# Altium schematic sheet LiPoBattery.SchDoc
size A4; SheetNumber: 1; SheetTotal: 1
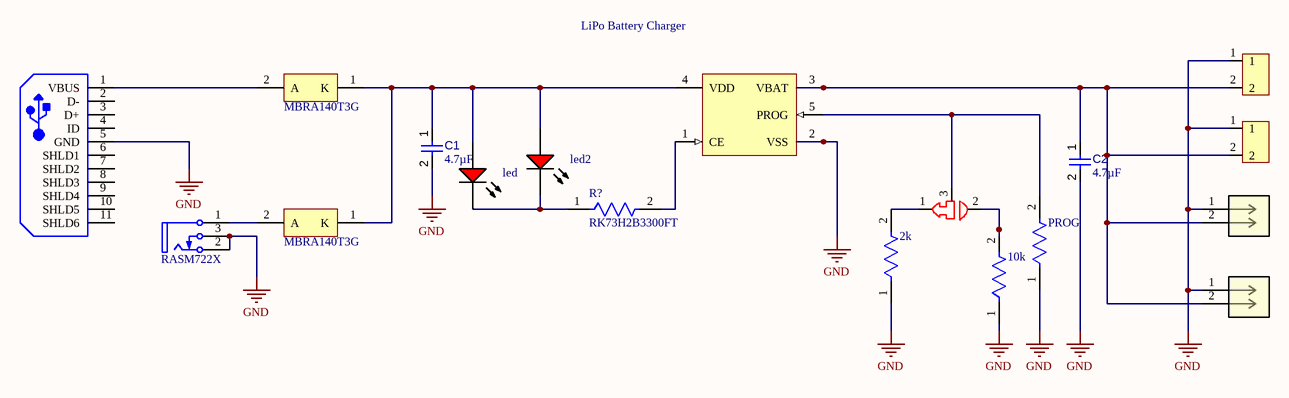
[diagram p0: LiPoBattery.SchDoc]

## Parts
(Parts that share a designator on the sheet are numbered #1, #2 ... from top to bottom, then left to right.)
2k  CR0603-JW-202GLF  [FP-CR0603-IPC_B]  (value not drawn)
10k  CRGP0603F10K  [FP-CRGP0603-IPC_C]  (value not drawn)
*#1  2 PIN HEADER  [PCBComponent_1 - duplicate]  (value not drawn)
*#2  2 PIN HEADER  [PCBComponent_1 - duplicate]  (value not drawn)
?  MCP73811T-420I/OT  [SOT-23-OT5_M]  (value not drawn)
C1  value 4.7µF  [CAPC0603(1608)100_L]  (hidden comment: Capacitor 4.7µF +/-20% 10V 0603)
C2  value 4.7µF  [CAPC0603(1608)100_L]  (hidden comment: Capacitor 4.7µF +/-20% 10V 0603)
D?#1  MBRA140T3G  [ONSC-SMA-2-403D-02_V]
D?#2  MBRA140T3G  [ONSC-SMA-2-403D-02_V]
J#1  1-179276-2  [PCBComponent_1]  (value not drawn)
J#2  1-179276-2  [PCBComponent_1]  (value not drawn)
J?#1  10103594-0001LF  [FCI-10103594-0001LF_V]  (value not drawn)
J?#2  RASM722X  [SWIT-RASM722X_V]
led  red  [VISH-TLMX1100_V]  (value not drawn)
led2  red  [VISH-TLMX1100_V]  (value not drawn)
PROG  CW02B8K200JE12  [FP-CW02B-MFG]  (value not drawn)
R?  RK73H2B3300FT  [FP-RK73H2B-IPC_C]
sjumper3pos  sjumper3pos-Symbol-1  [PCBComponent_1 - duplicate2]  (value not drawn)

## Nets
GND: 2k.1 10k.1 *#1.1 *#2.1 ?.2(VSS) C1.2 C2.2 J#1.1 J#2.1 J?#1.5(GND) J?#2.2(TIP) J?#2.3(SHUNT) PROG.1
Net2k_2: 2k.2 sjumper3pos.1
Net10k_2: 10k.2 sjumper3pos.2
Net*#1_2: *#1.2 *#2.2 ?.3(VBAT) C2.1 J#1.2 J#2.2
Net?_1: ?.1(CE) R?.2
Net?_4: ?.4(VDD) C1.1 D?#1.1(K) D?#2.1(K) led.1(A) led2.1(A)
Net?_5: ?.5(PROG) PROG.2 sjumper3pos.3
NetD?#1_2: D?#1.2(A) J?#1.1(VBUS)
NetD?#2_2: D?#2.2(A) J?#2.1(SLEEVE)
Netled_2: led.2(K) led2.2(K) R?.1

Not connected (* = marked no-connect by the designer): J?#1 2(D-) 3(D+) 4(ID) 6(SHLD1) 7(SHLD2) 8(SHLD3) 9(SHLD4) 10(SHLD5) 11(SHLD6)

## Notes on the sheet
- LiPo Battery Charger

## Library data of the parts
2k = CMP-07231-005094-1: Thick Film Chip Resistors 0603 2kΩ 0.1W 5% 200ppm/°C; Resistance: 2kR; Power Rating: 100mW; Voltage Rating: 50V; Mount: Surface Mount; Termination: SMD/SMT; Max Operating Temperature: 155°C; Depth: 0.8mm; Case Code (Imperial): 0603; Thickness: 457um; Military Standard: Not; Features: Moisture Resistant; Temperature Coefficient: 200ppm/°C; Length: 0.063inch; Case Code (Metric): 1608; Number of Terminations: 2; Packaging: Tape and Reel; Width: 0.031inch; Composition: Thick Film; Min Operating Temperature: -55°C; Height: 0.022inch; Package Quantity: 10000; Tolerance: 5%; Case/Package: 0603; Max Power Dissipation: 100mW
10k = CMP-03211-004414-1: CRGP 0603 10K 1%; Manufacturer: TE; Voltage Rating: 50V; Power Rating: 0.25W; Value: 10KΩ; Tolerance: 0.01; Temperature Coefficient: ±100ppm/°C; Octopart: https://octopart.com/crgp0603f10k-te+connectivity-91018721; Temperature Range Low: -55°C; Temperature Range High: +155°C; Device Class L3: Chip SMD Resistors; Package: CRGP0603; Height: 0.55mm; Series: CRGP; RoHS: TRUE; Composition: Thick Film; Digikey Description: CRGP 0603 10K 1%; Ipc Land Pattern Name: RESC16080X45; Mouser Description: Res, 10K, 1%, 0.25W, 0603, Thick Film; ComponentLink2Description: Datasheet; ComponentLink2URL: https://www.te.com/commerce/DocumentDelivery/DDEController?Action=srchrtrv&DocNm=9-1773463-9&DocType=DS&DocLang=English; Manufacturer Part Number: CRGP0603F10K; Temperature: -55°C to +155°C; Device Class L1: Passive Components; Lead Free: Yes; Ambient Temperature Range High: +70°C; Device Class L2: Resistors; Automotive: No; Category: Res; Resistance: 10KΩ
? = CMP-0133-00139-1: Simple, Miniature Single-Cell, Fully Integrated Li-Ion/Li-Polymer Charge Management Controller, 4.2V, 5-Pin SOT-23, Industrial Temperature, Tape and Reel; Code_IPC: SOT23-5; PackageDescription: 5-Lead Plastic Small Outline Transistor (OT) [SOT-23]; PackageVersion: revBB, Aug-2009; DatasheetVersion: revB, Sep-2007; PackageReference: SOT-23-OT5
C1 C2 = CMP-001-00076-4: Chip Capacitor, 4.7µF +/-20%, 10V, 0603, Thickness 1 mm; Tolerance: 10%; Mounting Technology: SMT; Case/Package: 0603; Pins: 2; Min Operating Temperature: -55°C; Max Operating Temperature: 85°C; Voltage Rating: 10V
D?#1 D?#2 = CMP-1055-00320-1: Schottky Power Rectifier, 2-Pin SMA, Pb-Free, Tape and Reel; Manufacturer: On Semiconductor; Configuration: Single; IFSM Max (A): 30; PackageReference: SMA-2-403D-02; PackageDescription: 2-Pin Small Molded Package, J-Bend Lead, Body 2.605 x 4.315 mm; RoHS: TRUE; ComponentLink1Description: Manufacturer URL; Packing: Tape and Reel; ComponentLink3URL: http://www.onsemi.com/pub_link/Collateral/403D-02.PDF; ComponentLink2Description: Datasheet; ComponentLink2URL: http://www.onsemi.cn/pub_link/Collateral/MBRA140T3-D.PDF; DatasheetVersion: Rev. 10; ComponentLink1URL: http://www.onsemi.com/; PartNumber: MBRA140T3G; ComponentLink3Description: Package Specification; Mounting Technology: Surface Mount; PackageVersion: Rev. G, 07/2012
J#1 J#2 = 1-179276-2: Dynamic 3000, 5.08MM Pitch 2 -way, 1 Row Right Angle Pcb Header, Solder Term; Manufacturer: TE Connectivity; Manufacturer Lifecycle Status: ACTIVE; Approvals: UL; Connector System: Wire-to-Board; Connector Type: Header, Plug, Tab; Contact Current Rating: 15A; Contact Retention: Without; Gender: Male; Insulation Resistance: 100MΩ; Mating Alignment: With; Max Voltage Rating (AC): 600V; Number of Contacts: 2; Number of Ports: 1; Operating Force: 4.8928N; PCB Thickness: 1.6002mm; Plating Thickness: 381nm; Preloaded: Yes; Sealable: No; Shielding: Unshielded; Tail Length: 3.8mm; Supplier: Arrow Electronics; Supplier Part Number: 1-179276-2; Manufacturer Part Number: 1-179276-2; RoHS: Compliant; Category: Headers and Wire Housings; Stock: 4048; Pricing: 1=2.1052, 26=1.6722, 104=1.5164, 520=1.3535, 1014=1.2943 (USD); China RoHS: Compliant; Color: Black; Contact Gender: Male; Contact Material: Gold, Nickel; Contact Plating: Gold, Tin; Current Rating: 15A; Depth: 22.1mm; Export Control Classification Number (ECCN) Code: EAR99; ELV: Compliant; Flammability Rating: UL94 V-0; Halogen Free: Halogen Free; Height: 11.25mm; Housing Color: Black; Housing Material: Nylon; Harmonized Tariff Schedule (HTS) Code: 8536.69.40.30; Introduction Date: 1997-09-06; Lead Free: Lead Free; Length: 19.0754mm; Lifecycle Status: Production; Mating Retention: With; Max Operating Temperature: 105°C; Min Operating Temperature: -55°C; Mounting Technology: Through Hole; Pins: 2; Number of Positions: 2; Number of Rows: 1; Number of Terminals: 2; Operating Supply Voltage: 600V; Orientation: Right Angle; Packaging: Bulk; PCB Mounting Orientation: Right Angle; PCB Mount Retention: With; Pitch: 5.08mm; Radiation Hardening: No; REACH SVHC: Yes; Terminal Pitch: 5.08mm; Termination: Solder; VDE Tested: No; Voltage Rating: 600V; Width: 22.098mm; ComponentLink1URL: https://datasheet.octopart.com:443/1-179276-2-TE-Connectivity-datasheet-179899453.pdf?src-supplier=IHS; ComponentLink1Description: https://datasheet.octopart.com:443/1-179276-2-TE-Connectivity-datasheet-179899453.pdf?src-supplier=IHS; ComponentLink2URL: https://sigma.octopart.com:443/15059836/technical_drawing/TE-Connectivity-1-179276-2.pdf?src-supplier=Farnell; ComponentLink2Description: https://sigma.octopart.com:443/15059836/technical_drawing/TE-Connectivity-1-179276-2.pdf?src-supplier=Farnell; ComponentLink3URL: https://datasheet.octopart.com:443/1-179276-2-TE-Connectivity-datasheet-42633666.pdf?src-supplier=Master+Electronics; ComponentLink3Description: https://datasheet.octopart.com:443/1-179276-2-TE-Connectivity-datasheet-42633666.pdf?src-supplier=Master+Electronics; ComponentLink4URL: https://datasheet.octopart.com:443/1-179276-2-TE-Connectivity---AMP-datasheet-181563238.pdf?src-supplier=Master+Electronics; ComponentLink4Description: https://datasheet.octopart.com:443/1-179276-2-TE-Connectivity---AMP-datasheet-181563238.pdf?src-supplier=Master+Electronics; ComponentLink5URL: https://datasheet.octopart.com:443/1-179276-2-TE-Connectivity-datasheet-11077907.pdf?src-supplier=Electro+Sonic; ComponentLink5Description: https://datasheet.octopart.com:443/1-179276-2-TE-Connectivity-datasheet-11077907.pdf?src-supplier=Electro+Sonic; ComponentLink6URL: https://datasheet.octopart.com:443/1-179276-2-TE-Connectivity-datasheet-155826164.pdf?src-supplier=TE+Connectivity; ComponentLink6Description: https://datasheet.octopart.com:443/1-179276-2-TE-Connectivity-datasheet-155826164.pdf?src-supplier=TE+Connectivity; ComponentLink7URL: https://datasheet.octopart.com:443/1-179276-2-Agastat-datasheet-15059020.pdf?src-supplier=TE+Connectivity; ComponentLink7Description: https://datasheet.octopart.com:443/1-179276-2-Agastat-datasheet-15059020.pdf?src-supplier=TE+Connectivity; ComponentLink8URL: https://datasheet.octopart.com:443/1-179276-2-Agastat-datasheet-15028295.pdf?src-supplier=TE+Connectivity; ComponentLink8Description: https://datasheet.octopart.com:443/1-179276-2-Agastat-datasheet-15028295.pdf?src-supplier=TE+Connectivity; ComponentLink9URL: https://datasheet.octopart.com:443/1-179276-2-AMP-datasheet-176864351.pdf?src-supplier=Burklin+Elektronik; ComponentLink9Description: https://datasheet.octopart.com:443/1-179276-2-AMP-datasheet-176864351.pdf?src-supplier=Burklin+Elektronik; ComponentLink10URL: https://datasheet.octopart.com:443/1-179276-2-TE-Connectivity-datasheet-101747747.pdf?src-supplier=Future+Electronics; ComponentLink10Description: https://datasheet.octopart.com:443/1-179276-2-TE-Connectivity-datasheet-101747747.pdf?src-supplier=Future+Electronics; ComponentLink11URL: https://datasheet.octopart.com:443/1-179276-2-TE-Connectivity-datasheet-111024656.pdf?src-supplier=RS+(Formerly+Allied+Electronics); ComponentLink11Description: https://datasheet.octopart.com:443/1-179276-2-TE-Connectivity-datasheet-111024656.pdf?src-supplier=RS+(Formerly+Allied+Electronics); ComponentLink12URL: http://sigma.octopart.com:80/38771343/materials_sheet/TE-Connectivity-1-179276-2.pdf?src-supplier=Compliance+Statements; ComponentLink12Description: http://sigma.octopart.com:80/38771343/materials_sheet/TE-Connectivity-1-179276-2.pdf?src-supplier=Compliance+Statements; ComponentLink13URL: http://sigma.octopart.com:80/136662181/materials_sheet/TE-Connectivity-1-179276-2.pdf?src-supplier=Compliance+Statements; ComponentLink13Description: http://sigma.octopart.com:80/136662181/materials_sheet/TE-Connectivity-1-179276-2.pdf?src-supplier=Compliance+Statements; ComponentLink14URL: http://sigma.octopart.com:80/15059835/rohs_certificate/Agastat-1-179276-2.pdf?src-supplier=Compliance+Statements; ComponentLink14Description: http://sigma.octopart.com:80/15059835/rohs_certificate/Agastat-1-179276-2.pdf?src-supplier=Compliance+Statements
J?#1 = CMP-002-00038-2: Micro USB 2.0 B Receptacle, 5 Position, Height 3.24 mm, -55 to 85 degC, RoHS, Tape and Reel; Manufacturer: FCI Electronics; Gender: Female; Current Rating: 1.8A; Voltage Rating: 100V; Min Operating Temperature: -55°C; Package Reference: FCI-10103594-0001LF; Max Operating Temperature: 85°C; Lead Pitch: 0.65mm; Case/Package: FCI-10103594-0001LF; Package Quantity: 1500; Connector Type: USB; Mounting Technology: SM; Datasheet Version: Rev. A, 06/2010; Contact Material: Copper; Package Description: 5-Pin Surface Mount Device, Body 8.04 x 5.62 mm; Contact Plating: Gold; Packaging: TapeandReel; Datasheet URL: http://portal.fciconnect.com/Comergent//fci/drawing/10103594.pdf; Pins: 5; RoHS Compliant: True; Manufacturer URL: http://portal.fciconnect.com/
J?#2 = CMP-002-00013-2: Power Jack, 5 A, 250 V, 3-Pin SMD, RoHS, Bulk; Manufacturer: Switchcraft; Connector Type: DCJack; Package Reference: RASM722X; Mounting Technology: SM; Manufacturer URL: http://www.switchcraft.com/; Datasheet URL: http://www.switchcraft.com/Drawings/rasm732x_cd.pdf; RoHS Compliant: Unknown; Datasheet Version: Rev. A, 09/2005; Package Description: 3-Pin Surface Mount Device, Body 14.5 x 9 mm; Case/Package: RASM722X
led led2 = CMP-007-00030-2: Red Led, 20mA, 2.1 V, -40 to 100 degC, 2-Pin SMD (0603), RoHS, Tape and Reel; Manufacturer: Vishay Semiconductor; Viewing Angle: 160degrees; Forward Voltage: 2.1V; Lens Style: Clear; Power: 90mW; Luminous Intensity: 63mcd; Datasheet Version: Rev. 2.7, 03/2016; Package Quantity: 3000; Colour: Red; Package Description: 2-Pin Surface Mount Device, Body 1.6 x 0.8 mm; Datasheet URL: http://www.vishay.com/docs/83173/tlmb1100.pdf; Package Reference: TLMX1100; Max Operating Temperature: 100°C; Mounting Technology: SM; Packaging: TapeandReel; Case/Package: 0603; Illumination Colour: Red; Forward Current: 20mA; Manufacturer URL: http://www.vishay.com/; RoHS Compliant: True; Min Operating Temperature: -40°C; Nominal Vf: 2.1V; Pins: 2
PROG = CMP-02408-000032-1: RES 8.2K OHM 3.75W 5% AXIAL; Temperature Coefficient: 30ppm/°C; Lead Diameter: 0.813mm; Resistance: 8.2kR; Power Rating: 3W; Tolerance: 5%; Max Operating Temperature: 250°C; Series: CW; Technology: WIRE WOUND; Resistor Type: Wirewound; Contact Plating: Tin; Diameter: 4.78mm; Package Quantity: 100; Min Operating Temperature: -65°C; Termination: Axial; Length: 15.8mm; Packaging: Bulk; RoHS Compliant: Yes; Mount: Through Hole; Case/Package: Conformal
R? = CMP-04015-094855-1: 330Ω ±1% 0.25W Chip Resistor 1206 Thick Film AEC-Q200 Qualified